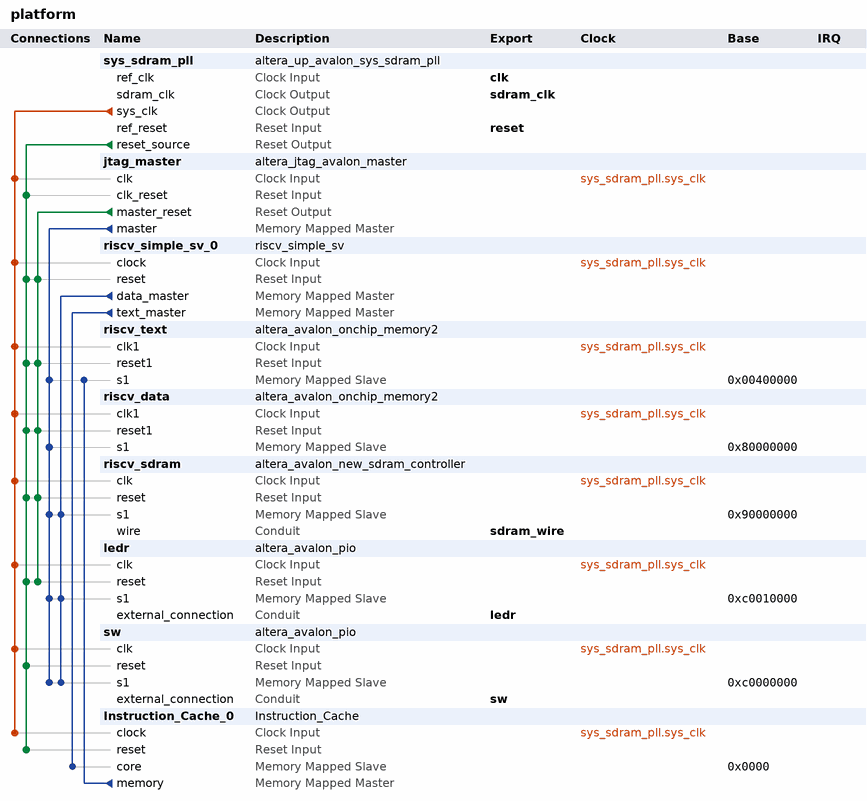
[diagram p0: system contents]
# Platform Designer (Qsys) system platform, Cyclone V 5CSEMA5F31C6
# Parameters at their usual value, and those the tool derives, are not listed.
package require -exact qsys 19.1
create_system platform
set_project_property DEVICE_FAMILY {Cyclone V}
set_project_property DEVICE 5CSEMA5F31C6

add_instance sys_sdram_pll altera_up_avalon_sys_sdram_pll 18.0
set_instance_parameter_value sys_sdram_pll CV_boards DE1-SoC
set_instance_parameter_value sys_sdram_pll gui_outclk 50.0
set_instance_parameter_value sys_sdram_pll gui_refclk 50.0

add_instance jtag_master altera_jtag_avalon_master 19.1

add_instance riscv_simple_sv_0 riscv_simple_sv 1.0

add_instance riscv_text altera_avalon_onchip_memory2 19.1
set_instance_parameter_value riscv_text blockType M10K
set_instance_parameter_value riscv_text dataWidth 32
set_instance_parameter_value riscv_text dualPort false
set_instance_parameter_value riscv_text initMemContent true
set_instance_parameter_value riscv_text initializationFileName onchip_mem.hex
set_instance_parameter_value riscv_text memorySize 65536

add_instance riscv_data altera_avalon_onchip_memory2 19.1
set_instance_parameter_value riscv_data blockType M10K
set_instance_parameter_value riscv_data dataWidth 32
set_instance_parameter_value riscv_data dualPort false
set_instance_parameter_value riscv_data initMemContent true
set_instance_parameter_value riscv_data initializationFileName onchip_mem.hex
set_instance_parameter_value riscv_data memorySize 131072

add_instance riscv_sdram altera_avalon_new_sdram_controller 19.1
set_instance_parameter_value riscv_sdram TAC 5.4
set_instance_parameter_value riscv_sdram TRCD 15.0
set_instance_parameter_value riscv_sdram TRP 15.0
set_instance_parameter_value riscv_sdram casLatency 3
set_instance_parameter_value riscv_sdram columnWidth 10
set_instance_parameter_value riscv_sdram dataWidth 16
set_instance_parameter_value riscv_sdram generateSimulationModel false
set_instance_parameter_value riscv_sdram model single_Micron_MT48LC4M32B2_7_chip
set_instance_parameter_value riscv_sdram numberOfBanks 4
set_instance_parameter_value riscv_sdram numberOfChipSelects 1
set_instance_parameter_value riscv_sdram powerUpDelay 100.0
set_instance_parameter_value riscv_sdram refreshPeriod 7.8125
set_instance_parameter_value riscv_sdram rowWidth 13

add_instance ledr altera_avalon_pio 19.1
set_instance_parameter_value ledr direction Output
set_instance_parameter_value ledr width 10

add_instance sw altera_avalon_pio 19.1
set_instance_parameter_value sw direction Input
set_instance_parameter_value sw width 10

add_instance Instruction_Cache_0 Instruction_Cache 1.0
set_instance_parameter_value Instruction_Cache_0 bits_for_index 6
set_instance_parameter_value Instruction_Cache_0 bits_for_offset 6
set_instance_parameter_value Instruction_Cache_0 log_of_number_of_sets 2
set_instance_parameter_value Instruction_Cache_0 number_of_sets 4

# connections
add_connection sys_sdram_pll.sys_clk Instruction_Cache_0.clock clock
add_connection sys_sdram_pll.sys_clk jtag_master.clk clock
add_connection sys_sdram_pll.sys_clk ledr.clk clock
add_connection sys_sdram_pll.sys_clk riscv_data.clk1 clock
add_connection sys_sdram_pll.sys_clk riscv_sdram.clk clock
add_connection sys_sdram_pll.sys_clk riscv_simple_sv_0.clock clock
add_connection sys_sdram_pll.sys_clk riscv_text.clk1 clock
add_connection sys_sdram_pll.sys_clk sw.clk clock
add_connection jtag_master.master_reset ledr.reset reset
add_connection jtag_master.master_reset riscv_data.reset1 reset
add_connection jtag_master.master_reset riscv_sdram.reset reset
add_connection jtag_master.master_reset riscv_simple_sv_0.reset reset
add_connection jtag_master.master_reset riscv_text.reset1 reset
add_connection sys_sdram_pll.reset_source Instruction_Cache_0.reset reset
add_connection sys_sdram_pll.reset_source jtag_master.clk_reset reset
add_connection sys_sdram_pll.reset_source ledr.reset reset
add_connection sys_sdram_pll.reset_source riscv_data.reset1 reset
add_connection sys_sdram_pll.reset_source riscv_sdram.reset reset
add_connection sys_sdram_pll.reset_source riscv_simple_sv_0.reset reset
add_connection sys_sdram_pll.reset_source riscv_text.reset1 reset
add_connection sys_sdram_pll.reset_source sw.reset reset
add_connection Instruction_Cache_0.memory riscv_text.s1 avalon
set_connection_parameter_value Instruction_Cache_0.memory/riscv_text.s1 baseAddress 0x00400000
add_connection jtag_master.master ledr.s1 avalon
set_connection_parameter_value jtag_master.master/ledr.s1 baseAddress 0xc0010000
add_connection jtag_master.master riscv_data.s1 avalon
set_connection_parameter_value jtag_master.master/riscv_data.s1 baseAddress 0x80000000
add_connection jtag_master.master riscv_sdram.s1 avalon
set_connection_parameter_value jtag_master.master/riscv_sdram.s1 baseAddress 0x90000000
add_connection jtag_master.master riscv_text.s1 avalon
set_connection_parameter_value jtag_master.master/riscv_text.s1 baseAddress 0x00400000
add_connection jtag_master.master sw.s1 avalon
set_connection_parameter_value jtag_master.master/sw.s1 baseAddress 0xc0000000
add_connection riscv_simple_sv_0.data_master ledr.s1 avalon
set_connection_parameter_value riscv_simple_sv_0.data_master/ledr.s1 baseAddress 0xc0010000
add_connection riscv_simple_sv_0.data_master riscv_sdram.s1 avalon
set_connection_parameter_value riscv_simple_sv_0.data_master/riscv_sdram.s1 baseAddress 0x90000000
add_connection riscv_simple_sv_0.data_master sw.s1 avalon
set_connection_parameter_value riscv_simple_sv_0.data_master/sw.s1 baseAddress 0xc0000000
add_connection riscv_simple_sv_0.text_master Instruction_Cache_0.core avalon
set_connection_parameter_value riscv_simple_sv_0.text_master/Instruction_Cache_0.core baseAddress 0x0000

# exported interfaces
add_interface clk clock sink
set_interface_property clk EXPORT_OF sys_sdram_pll.ref_clk
add_interface ledr conduit end
set_interface_property ledr EXPORT_OF ledr.external_connection
add_interface reset reset sink
set_interface_property reset EXPORT_OF sys_sdram_pll.ref_reset
add_interface sdram_clk clock source
set_interface_property sdram_clk EXPORT_OF sys_sdram_pll.sdram_clk
add_interface sdram_wire conduit end
set_interface_property sdram_wire EXPORT_OF riscv_sdram.wire
add_interface sw conduit end
set_interface_property sw EXPORT_OF sw.external_connection

set_interconnect_requirement {$system} qsys_mm.clockCrossingAdapter HANDSHAKE
set_interconnect_requirement {$system} qsys_mm.enableEccProtection FALSE
set_interconnect_requirement {$system} qsys_mm.insertDefaultSlave FALSE
set_interconnect_requirement {$system} qsys_mm.maxAdditionalLatency 1

save_system platform.qsys
